# EAGLE design TestBoard2 (EAGLE 6.4)
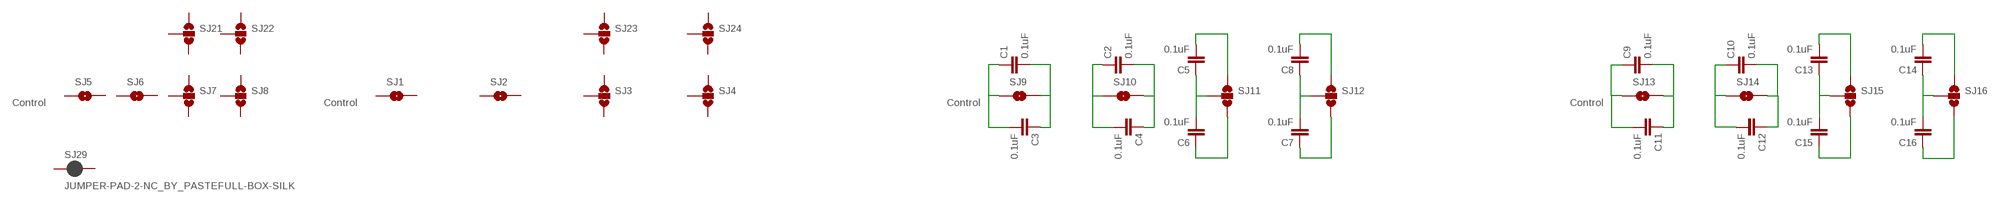
[diagram p0: schematic, sheet 1, part 1 of 3]
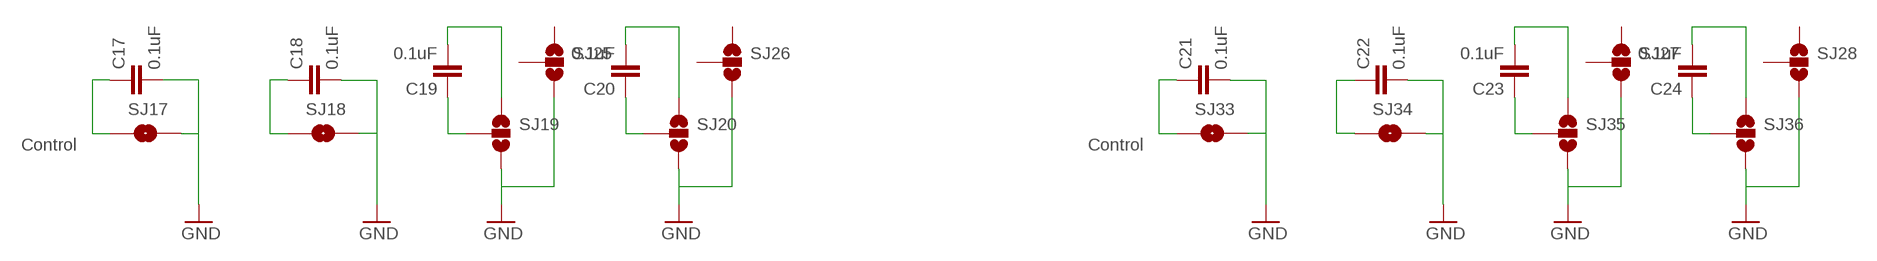
[diagram p1: schematic, sheet 1, part 2 of 3]
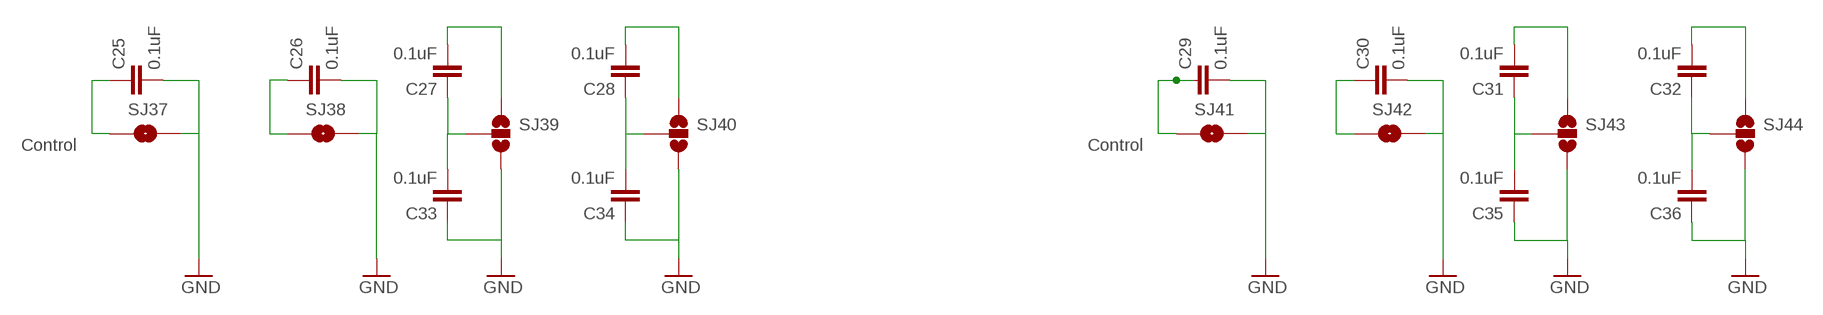
[diagram p2: schematic, sheet 1, part 3 of 3]

## Parts
C1  0.1uF  0.1UF-25V-5%(0603)  [0603-CAP]
C2  0.1uF  0.1UF-25V-5%(0603)  [0603-CAP]
C3  0.1uF  0.1UF-25V-5%(0603)  [0603-CAP]
C4  0.1uF  0.1UF-25V-5%(0603)  [0603-CAP]
C5  0.1uF  0.1UF-25V-5%(0603)  [0603-CAP]
C6  0.1uF  0.1UF-25V-5%(0603)  [0603-CAP]
C7  0.1uF  0.1UF-25V-5%(0603)  [0603-CAP]
C8  0.1uF  0.1UF-25V-5%(0603)  [0603-CAP]
C9  0.1uF  0.1UF-25V-5%(0603)  [0603-CAP]
C10  0.1uF  0.1UF-25V-5%(0603)  [0603-CAP]
C11  0.1uF  0.1UF-25V-5%(0603)  [0603-CAP]
C12  0.1uF  0.1UF-25V-5%(0603)  [0603-CAP]
C13  0.1uF  0.1UF-25V-5%(0603)  [0603-CAP]
C14  0.1uF  0.1UF-25V-5%(0603)  [0603-CAP]
C15  0.1uF  0.1UF-25V-5%(0603)  [0603-CAP]
C16  0.1uF  0.1UF-25V-5%(0603)  [0603-CAP]
C17  0.1uF  0.1UF-25V-5%(0603)  [0603-CAP]
C18  0.1uF  0.1UF-25V-5%(0603)  [0603-CAP]
C19  0.1uF  0.1UF-25V-5%(0603)  [0603-CAP]
C20  0.1uF  0.1UF-25V-5%(0603)  [0603-CAP]
C21  0.1uF  0.1UF-25V-5%(0603)  [0603-CAP]
C22  0.1uF  0.1UF-25V-5%(0603)  [0603-CAP]
C23  0.1uF  0.1UF-25V-5%(0603)  [0603-CAP]
C24  0.1uF  0.1UF-25V-5%(0603)  [0603-CAP]
C25  0.1uF  0.1UF-25V-5%(0603)  [0603-CAP]
C26  0.1uF  0.1UF-25V-5%(0603)  [0603-CAP]
C27  0.1uF  0.1UF-25V-5%(0603)  [0603-CAP]
C28  0.1uF  0.1UF-25V-5%(0603)  [0603-CAP]
C29  0.1uF  0.1UF-25V-5%(0603)  [0603-CAP]
C30  0.1uF  0.1UF-25V-5%(0603)  [0603-CAP]
C31  0.1uF  0.1UF-25V-5%(0603)  [0603-CAP]
C32  0.1uF  0.1UF-25V-5%(0603)  [0603-CAP]
C33  0.1uF  0.1UF-25V-5%(0603)  [0603-CAP]
C34  0.1uF  0.1UF-25V-5%(0603)  [0603-CAP]
C35  0.1uF  0.1UF-25V-5%(0603)  [0603-CAP]
C36  0.1uF  0.1UF-25V-5%(0603)  [0603-CAP]
SJ1  JUMPER-PAD-2-NO  [PAD-JUMPER-2-NO_NO_SILK]
SJ2  JUMPER-PAD-2-NO  [PAD-JUMPER-2-NO_NO_SILK]
SJ3  JUMPER-PAD-3-NOYES_SILK  [PAD-JUMPER-3-NO_YES_SILK]
SJ4  JUMPER-PAD-3-NOYES_SILK  [PAD-JUMPER-3-NO_YES_SILK]
SJ5  JUMPER-PAD-2-NO  [PAD-JUMPER-2-NO_NO_SILK]
SJ6  JUMPER-PAD-2-NO  [PAD-JUMPER-2-NO_NO_SILK]
SJ7  JUMPER-PAD-3-NOYES_SILK  [PAD-JUMPER-3-NO_YES_SILK]
SJ8  JUMPER-PAD-3-NOYES_SILK  [PAD-JUMPER-3-NO_YES_SILK]
SJ9  JUMPER-PAD-2-NO  [PAD-JUMPER-2-NO_NO_SILK]
SJ10  JUMPER-PAD-2-NO  [PAD-JUMPER-2-NO_NO_SILK]
SJ11  JUMPER-PAD-3-NOYES_SILK  [PAD-JUMPER-3-NO_YES_SILK]
SJ12  JUMPER-PAD-3-NOYES_SILK  [PAD-JUMPER-3-NO_YES_SILK]
SJ13  JUMPER-PAD-2-NO  [PAD-JUMPER-2-NO_NO_SILK]
SJ14  JUMPER-PAD-2-NO  [PAD-JUMPER-2-NO_NO_SILK]
SJ15  JUMPER-PAD-3-NOYES_SILK  [PAD-JUMPER-3-NO_YES_SILK]
SJ16  JUMPER-PAD-3-NOYES_SILK  [PAD-JUMPER-3-NO_YES_SILK]
SJ17  JUMPER-PAD-2-NO  [PAD-JUMPER-2-NO_NO_SILK]
SJ18  JUMPER-PAD-2-NO  [PAD-JUMPER-2-NO_NO_SILK]
SJ19  JUMPER-PAD-3-NOYES_SILK  [PAD-JUMPER-3-NO_YES_SILK]
SJ20  JUMPER-PAD-3-NOYES_SILK  [PAD-JUMPER-3-NO_YES_SILK]
SJ21  JUMPER-PAD-3-NOYES_SILK  [PAD-JUMPER-3-NO_YES_SILK]
SJ22  JUMPER-PAD-3-NOYES_SILK  [PAD-JUMPER-3-NO_YES_SILK]
SJ23  JUMPER-PAD-3-NOYES_SILK  [PAD-JUMPER-3-NO_YES_SILK]
SJ24  JUMPER-PAD-3-NOYES_SILK  [PAD-JUMPER-3-NO_YES_SILK]
SJ25  JUMPER-PAD-3-NOYES_SILK  [PAD-JUMPER-3-NO_YES_SILK]
SJ26  JUMPER-PAD-3-NOYES_SILK  [PAD-JUMPER-3-NO_YES_SILK]
SJ27  JUMPER-PAD-3-NOYES_SILK  [PAD-JUMPER-3-NO_YES_SILK]
SJ28  JUMPER-PAD-3-NOYES_SILK  [PAD-JUMPER-3-NO_YES_SILK]
SJ29  JUMPER-PAD-2-NC_BY_PASTEFULL-BOX-SILK  [PAD-JUMPER-2-NC_BY_PASTE_YES_SILK_FULL_BOX]
SJ33  JUMPER-PAD-2-NO  [PAD-JUMPER-2-NO_NO_SILK]
SJ34  JUMPER-PAD-2-NO  [PAD-JUMPER-2-NO_NO_SILK]
SJ35  JUMPER-PAD-3-NOYES_SILK  [PAD-JUMPER-3-NO_YES_SILK]
SJ36  JUMPER-PAD-3-NOYES_SILK  [PAD-JUMPER-3-NO_YES_SILK]
SJ37  JUMPER-PAD-2-NO  [PAD-JUMPER-2-NO_NO_SILK]
SJ38  JUMPER-PAD-2-NO  [PAD-JUMPER-2-NO_NO_SILK]
SJ39  JUMPER-PAD-3-NOYES_SILK  [PAD-JUMPER-3-NO_YES_SILK]
SJ40  JUMPER-PAD-3-NOYES_SILK  [PAD-JUMPER-3-NO_YES_SILK]
SJ41  JUMPER-PAD-2-NO  [PAD-JUMPER-2-NO_NO_SILK]
SJ42  JUMPER-PAD-2-NO  [PAD-JUMPER-2-NO_NO_SILK]
SJ43  JUMPER-PAD-3-NOYES_SILK  [PAD-JUMPER-3-NO_YES_SILK]
SJ44  JUMPER-PAD-3-NOYES_SILK  [PAD-JUMPER-3-NO_YES_SILK]

## Nets
GND: C17.2 C18.2 C21.2 C22.2 C25.2 C26.2 C29.2 C30.2 C33.1 C34.1 C35.1 C36.1 SJ17.2 SJ18.2 SJ19.3 SJ20.3 SJ25.3 SJ26.3 SJ27.3 SJ28.3 SJ33.2 SJ34.2 SJ35.3 SJ36.3 SJ37.2 SJ38.2 SJ39.3 SJ40.3 SJ41.2 SJ42.2 SJ43.3 SJ44.3
N$1: C1.1 C3.2 SJ9.1
N$2: C1.2 C3.1 SJ9.2
N$3: C2.1 C4.2 SJ10.1
N$4: C2.2 C4.1 SJ10.2
N$5: C5.1 C6.2 SJ11.2
N$6: C5.2 SJ11.1
N$7: C6.1 SJ11.3
N$8: C7.2 C8.1 SJ12.2
N$9: C8.2 SJ12.1
N$10: C7.1 SJ12.3
N$11: C10.2 C12.1 SJ14.2
N$12: C10.1 C12.2 SJ14.1
N$13: C9.1 C11.2 SJ13.1
N$14: C9.2 C11.1 SJ13.2
N$15: C13.1 C15.2 SJ15.2
N$16: C13.2 SJ15.1
N$17: C15.1 SJ15.3
N$18: C14.1 C16.2 SJ16.2
N$19: C14.2 SJ16.1
N$20: C16.1 SJ16.3
N$21: C17.1 SJ17.1
N$22: C18.1 SJ18.1
N$24: C19.1 SJ19.2
N$25: C19.2 SJ19.1
N$26: C20.1 SJ20.2
N$27: C20.2 SJ20.1
N$28: C21.1 SJ33.1
N$30: C22.1 SJ34.1
N$31: C23.1 SJ35.2
N$32: C23.2 SJ35.1
N$33: C24.2 SJ36.1
N$34: C24.1 SJ36.2
N$35: C25.1 SJ37.1
N$37: C26.1 SJ38.1
N$39: C27.1 C33.2 SJ39.2
N$40: C27.2 SJ39.1
N$42: C28.1 C34.2 SJ40.2
N$43: C28.2 SJ40.1
N$45: C29.1 SJ41.1
N$47: C30.1 SJ42.1
N$49: C31.1 C35.2 SJ43.2
N$50: C31.2 SJ43.1
N$51: C32.1 C36.2 SJ44.2
N$52: C32.2 SJ44.1
Unconnected: SJ1.1 SJ1.2 SJ2.1 SJ2.2 SJ3.1 SJ3.2 SJ3.3 SJ4.1 SJ4.2 SJ4.3 SJ5.1 SJ5.2 SJ6.1 SJ6.2 SJ7.1 SJ7.2 SJ7.3 SJ8.1 SJ8.2 SJ8.3 SJ21.1 SJ21.2 SJ21.3 SJ22.1 SJ22.2 SJ22.3 SJ23.1 SJ23.2 SJ23.3 SJ24.1 SJ24.2 SJ24.3 SJ25.1 SJ25.2 SJ26.1 SJ26.2 SJ27.1 SJ27.2 SJ28.1 SJ28.2 SJ29.1 SJ29.2

## Notes on the sheet
- Control | Control | Control | Control | Control | Control | Control | Control

## Library data of the parts
C1-C36 = SparkFun-Capacitors:0.1UF-25V-5%(0603): CAP-08604; PROD_ID: CAP-08604
SJ1 SJ2 SJ5 SJ6 SJ9 SJ10 SJ13 SJ14 SJ17 SJ18 SJ33 SJ34 SJ37 SJ38 SJ41 SJ42 = TestAperatures:JUMPER-PAD-2-NO
SJ3 SJ4 SJ7 SJ8 SJ11 SJ12 SJ15 SJ16 SJ19-SJ28 SJ35 SJ36 SJ39 SJ40 SJ43 SJ44 = TestAperatures:JUMPER-PAD-3-NO
SJ29 = SparkFun-Passives:JUMPER-PAD-2-NC_BY_PASTE

## Board
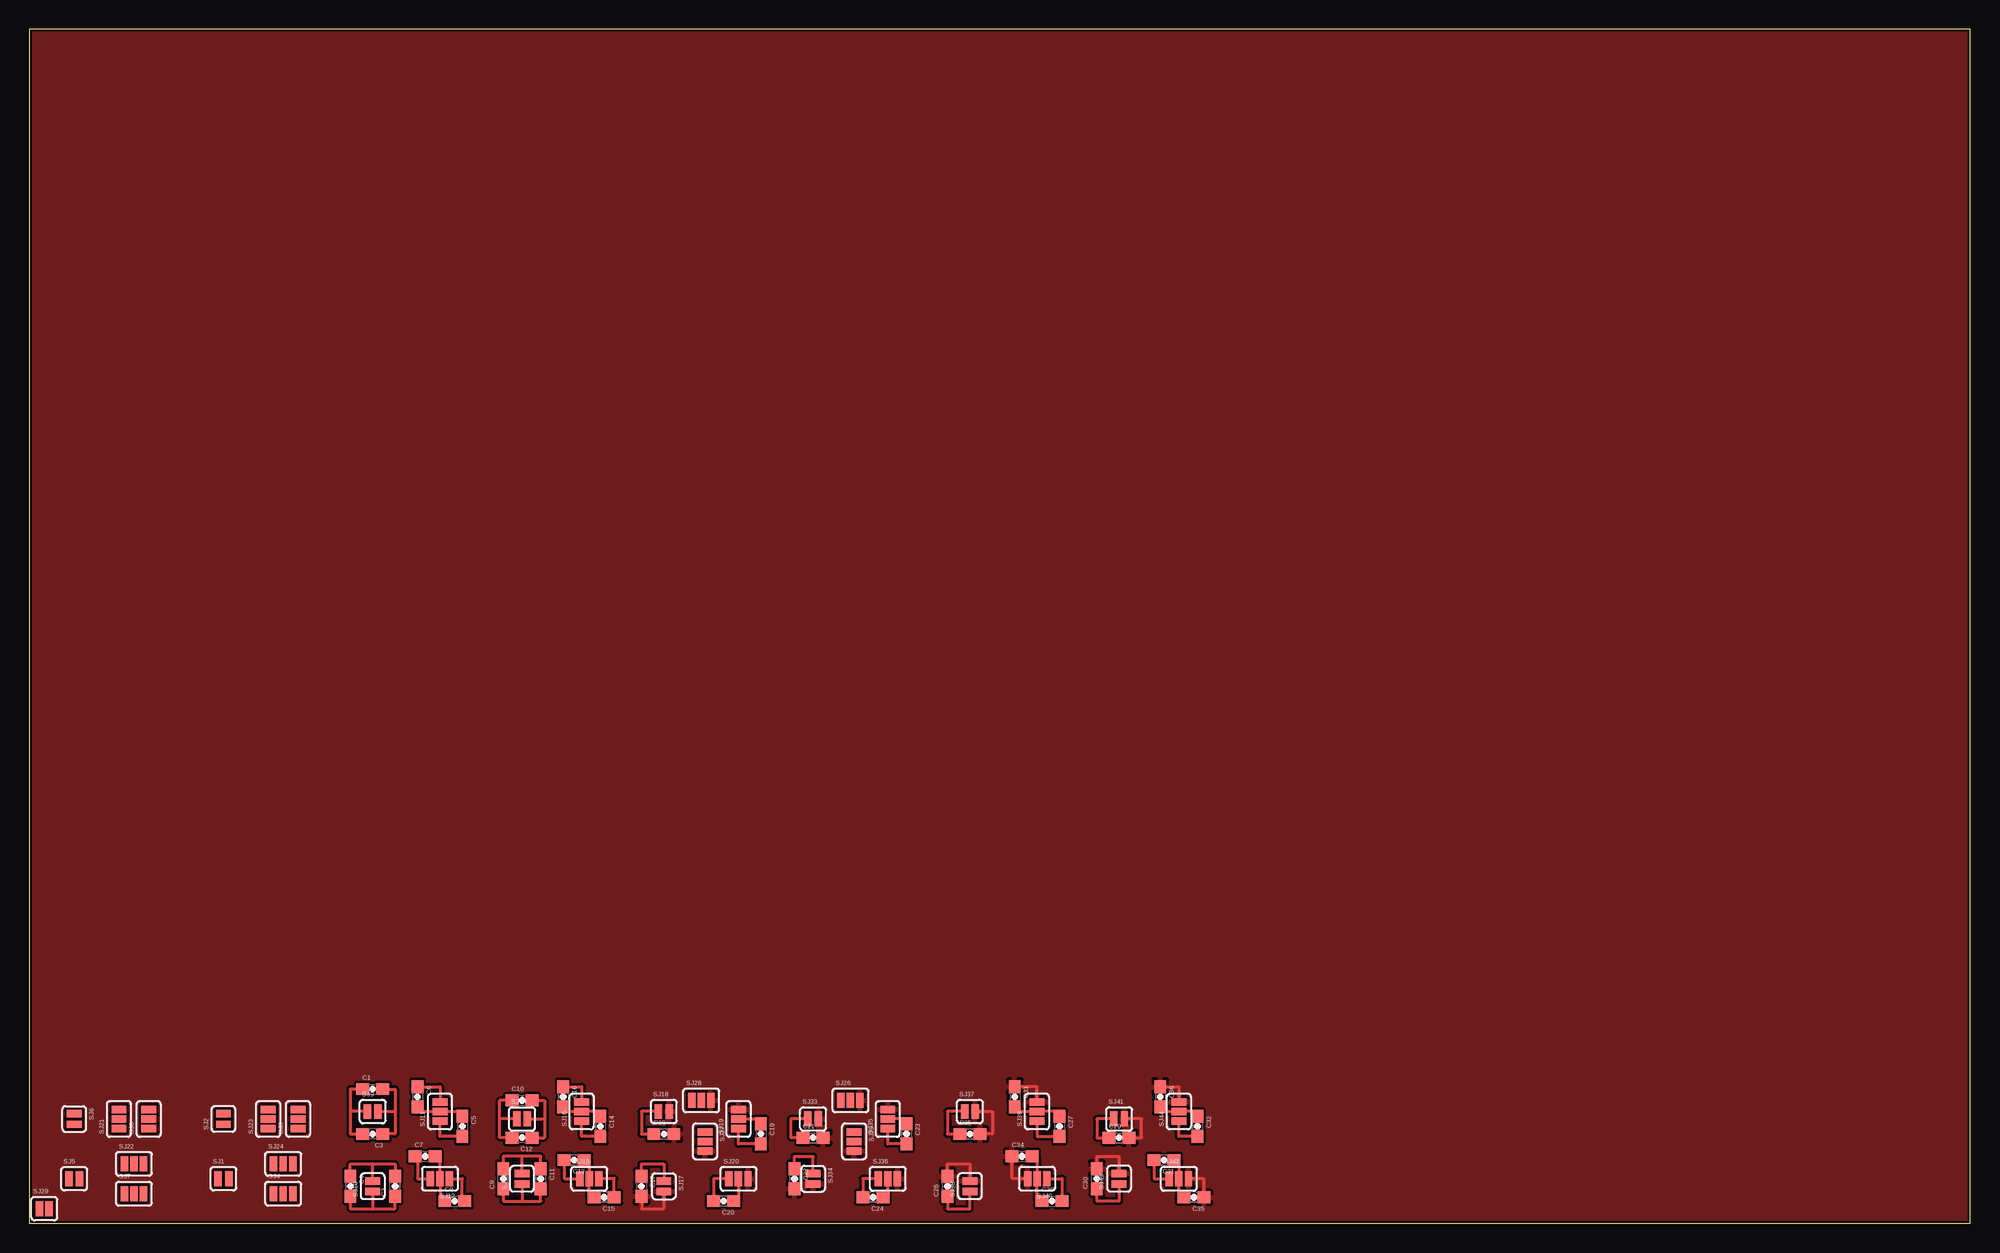
[diagram p3: board, top side]

Size 165.1 x 101.6 mm. Coordinates in mm from the lower left corner, seen from the top.
Outline: 0,0 165.1,0 165.1,101.6 0,101.6 0,0
Copper layers (1*16): Top 0.035mm / dielectric 1.5mm / Bottom 0.035mm
Design rules "SparkFun-2-layer": minimum track width 7mil, minimum drill 15mil, track to track 8mil, track to pad 8mil, pad to pad 8mil, via to via 8mil, smd to smd 8mil, copper to edge 8mil, drill to drill 8mil, minimum pad ring 12mil, minimum via ring 10mil, stop-mask expansion 4mil, vias tented up to drill 20mil, thermal gap 10mil

### Footprints (pad centres in the part's own frame; a part is rotated, then mirrored left to right if it is on the bottom)
0603-CAP = smd 1.1 x 1: 1 -0.85,0; 2 0.85,0
PAD-JUMPER-2-NO_NO_SILK = smd 0.635 x 1.27: 1 -0.45,0; 2 0.45,0
PAD-JUMPER-3-NO_YES_SILK = smd 0.635 x 1.27: 1 -0.813,0; 2 0,0; 3 0.813,0
PAD-JUMPER-2-NC_BY_PASTE_YES_SILK_FULL_BOX = smd 0.635 x 1.27: 1 -0.412,0; 2 0.412,0

### Placement (x,y rotation side)
C1  29.21,11.43 0 top
C2  31.11,3.17 90 top
C3  29.21,7.62 180 top
C4  27.3,3.17 270 top
C5  36.83,8.26 270 top
C6  33.02,10.79 270 top
C7  33.66,5.71 0 top
C8  36.2,1.91 0 top
C9  40.32,3.81 90 top
C10  41.91,10.48 0 top
C11  43.5,3.81 270 top
C12  41.91,7.3 180 top
C13  46.35,5.4 180 top
C14  48.58,8.26 270 top
C15  48.9,2.22 180 top
C16  45.4,10.79 270 top
C17  52.07,3.17 270 top
C18  53.98,7.62 0 top
C19  62.23,7.62 270 top
C20  59.05,1.91 180 top
C21  66.67,7.3 0 top
C22  65.09,3.81 270 top
C23  74.61,7.62 270 top
C24  71.75,2.22 180 top
C25  80.01,7.62 0 top
C26  78.11,3.17 90 top
C27  87.63,8.26 270 top
C28  87,1.91 0 top
C29  92.71,7.3 0 top
C30  90.81,3.81 90 top
C31  96.52,5.4 180 top
C32  99.38,8.26 270 top
C33  83.82,10.79 270 top
C34  84.45,5.71 0 top
C35  99.06,2.22 180 top
C36  96.2,10.79 270 top
SJ1  16.51,3.81 0 top
SJ2  16.51,8.89 90 top
SJ3  22.86,8.89 90 top
SJ4  21.59,2.54 0 top
SJ5  3.81,3.81 0 top
SJ6  3.81,8.89 270 top
SJ7  8.89,2.54 0 top
SJ8  10.16,8.89 90 top
SJ9  29.21,9.53 0 top
SJ10  29.21,3.17 90 top
SJ11  34.92,9.53 90 top
SJ12  34.92,3.81 180 top
SJ13  41.91,3.81 90 top
SJ14  41.91,8.89 0 top
SJ15  47.62,3.81 0 top
SJ16  46.99,9.53 90 top
SJ17  53.98,3.17 270 top
SJ18  53.98,9.53 0 top
SJ19  60.33,8.89 90 top
SJ20  60.33,3.81 0 top
SJ21  7.62,8.89 90 top
SJ22  8.89,5.08 0 top
SJ23  20.32,8.89 90 top
SJ24  21.59,5.08 0 top
SJ25  70.17,6.99 270 top
SJ26  69.85,10.48 0 top
SJ27  57.47,6.99 270 top
SJ28  57.15,10.48 0 top
SJ29  1.27,1.27 0 top
SJ33  66.67,8.89 0 top
SJ34  66.67,3.81 270 top
SJ35  73.03,8.89 90 top
SJ36  73.03,3.81 0 top
SJ37  80.01,9.53 0 top
SJ38  80.01,3.17 90 top
SJ39  85.72,9.53 90 top
SJ40  85.72,3.81 180 top
SJ41  92.71,8.89 0 top
SJ42  92.71,3.81 90 top
SJ43  97.79,3.81 0 top
SJ44  97.79,9.53 90 top

### Tracks (layer width: path | path; a pad name or v marks a point on that pad's centre or on a via)
GND
  Top 0.254: C17.2 52.07,1.27 53.98,1.27 SJ17.2 | C29.2 94.61,7.3 94.61,8.89 SJ41.2 | C30.2 90.81,5.71 92.71,5.71 SJ42.2 | C35.1 99.91,3.81 SJ43.3 | C36.1 97.79,11.64 SJ44.3 | SJ37.2 81.92,9.53 81.92,7.62 C25.2 | C26.2 78.11,5.08 80.01,5.08 SJ38.2 | SJ39.3 85.72,11.64 C33.1 | SJ40.3 83.61,3.81 C34.1
  pour Top: 0,101.6 165.1,101.6 165.1,0 0,0
N$1
  Top 0.254: C1.1 27.3,11.43 27.3,9.53 | 27.3,9.53 27.3,7.62 C3.2 | SJ9.1 27.3,9.53
N$2
  Top 0.254: C1.2 31.11,11.43 31.11,9.53 | 31.11,9.53 31.11,7.62 C3.1 | SJ9.2 31.11,9.53
N$3
  Top 0.254: C4.2 27.3,1.27 29.21,1.27 | 29.21,1.27 31.11,1.27 C2.1 | SJ10.1 29.21,1.27
N$4
  Top 0.254: C4.1 27.3,5.08 29.21,5.08 | 29.21,5.08 31.11,5.08 C2.2 | SJ10.2 29.21,5.08
N$5
  Top 0.254: C6.2 33.02,9.53 SJ11.2 36.83,9.53 C5.1
N$6
  Top 0.254: 34.92,8.89 SJ11.1 34.92,7.41 C5.2
N$7
  Top 0.254: C6.1 34.92,11.64 SJ11.3
N$8
  Top 0.254: C7.2 34.92,5.71 SJ12.2 34.92,1.91 C8.1
N$9
  Top 0.254: SJ12.1 36.83,3.81 36.83,1.91 C8.2
N$10
  Top 0.254: C7.1 33.02,5.71 33.02,3.81 SJ12.3
N$11
  Top 0.254: C10.2 43.81,10.48 43.81,8.89 | 43.81,8.89 43.81,7.3 C12.1 | SJ14.2 43.81,8.89
N$12
  Top 0.254: C12.2 40.01,7.3 40.01,8.89 | 40.01,8.89 40.01,10.48 C10.1 | SJ14.1 40.01,8.89
N$13
  Top 0.254: C9.1 40.32,1.91 41.91,1.91 | 41.91,1.91 43.5,1.91 C11.2 | SJ13.1 41.91,1.91
N$14
  Top 0.254: C11.1 43.5,5.71 41.91,5.71 | 41.91,5.71 40.32,5.71 C9.2 | SJ13.2 41.91,5.71
N$15
  Top 0.254: C15.2 47.62,2.22 SJ15.2 47.62,5.4 C13.1
N$16
  Top 0.254: C13.2 45.51,3.81 SJ15.1
N$17
  Top 0.254: C15.1 49.74,3.81 SJ15.3
N$18
  Top 0.254: C16.2 45.4,9.53 SJ16.2 48.58,9.53 C14.1
N$19
  Top 0.254: C14.2 46.99,7.41 SJ16.1
N$20
  Top 0.254: C16.1 46.99,11.64 SJ16.3
N$21
  Top 0.254: C17.1 52.07,5.08 53.98,5.08 SJ17.1
N$22
  Top 0.254: SJ18.1 52.07,9.53 52.07,7.62 C18.1
N$24
  Top 0.254: SJ19.2 62.23,8.89 C19.1
N$25
  Top 0.254: 60.33,8.26 SJ19.1 60.33,6.77 C19.2
N$26
  Top 0.254: SJ20.2 60.33,1.91 C20.1
N$27
  Top 0.254: 58.42,1.91 C20.2 58.2,3.81 SJ20.1
N$28
  Top 0.254: SJ33.1 64.77,8.89 64.77,7.3 C21.1
N$30
  Top 0.254: C22.1 65.09,5.71 66.67,5.71 SJ34.1
N$31
  Top 0.254: C23.1 74.61,8.89 SJ35.2
N$32
  Top 0.254: C23.2 73.03,6.77 SJ35.1
N$33
  Top 0.254: SJ36.1 70.91,3.81 C24.2
N$34
  Top 0.254: C24.1 73.03,2.22 SJ36.2
N$35
  Top 0.254: SJ37.1 78.11,9.53 78.11,7.62 C25.1
N$37
  Top 0.254: C26.1 78.11,1.27 80.01,1.27 SJ38.1
N$39
  Top 0.254: C27.1 87.63,9.53 SJ39.2 83.82,9.53 C33.2
N$40
  Top 0.254: SJ39.1 85.72,7.41 C27.2
N$42
  Top 0.254: C28.1 85.72,1.91 SJ40.2 85.72,5.71 C34.2
N$43
  Top 0.254: SJ40.1 87.84,3.81 C28.2
N$45
  Top 0.254: SJ41.1 90.81,8.89 90.81,7.3 C29.1
N$47
  Top 0.254: SJ42.1 92.71,1.91 90.81,1.91 C30.1
N$49
  Top 0.254: C31.1 97.79,5.4 SJ43.2 97.79,2.22 C35.2
N$50
  Top 0.254: C31.2 95.67,3.81 SJ43.1
N$51
  Top 0.254: C32.1 99.38,9.53 SJ44.2 96.2,9.53 C36.2
N$52
  Top 0.254: C32.2 97.79,7.41 SJ44.1

### Text on the board
Reference: 70% | 60% | 50% | 40% | 30% | Control | 20% | 10%